# Altium project interface.PrjPcb
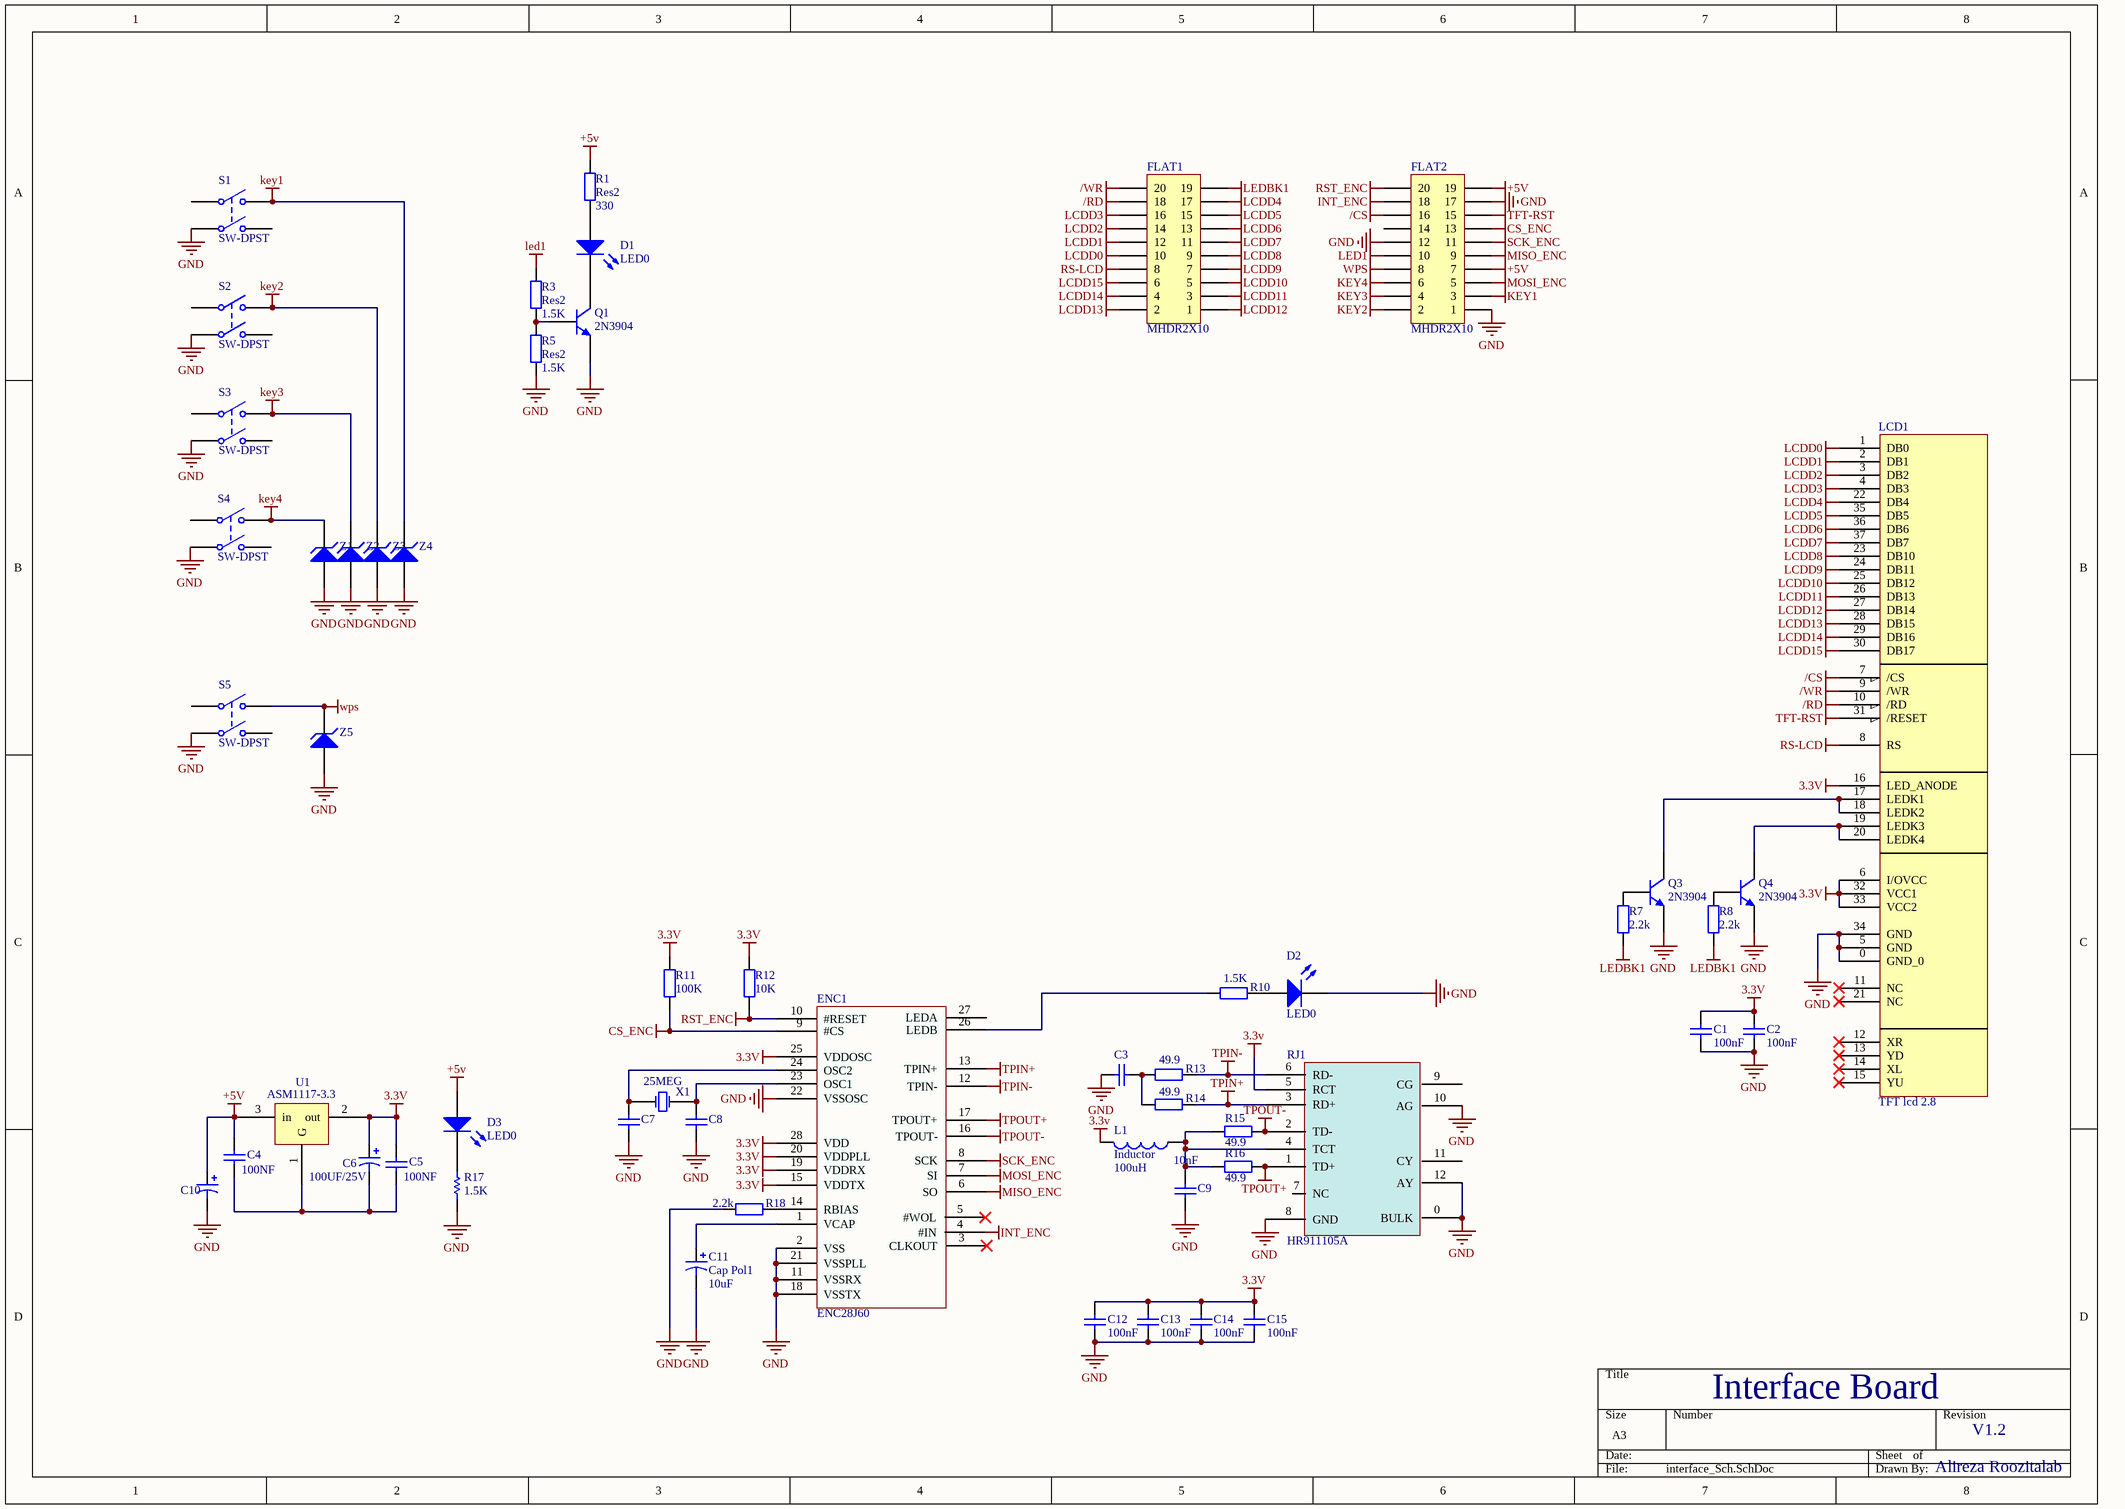
[diagram p0: interface_Sch.SchDoc]
1 sheet, 53 parts. Net scope: global (net labels, ports and power ports of the same name join across sheets).
Board file: interface_pcb.PcbDoc

## Sheet interface_Sch.SchDoc
size A3

### Parts
C1  value 100nF  [CAP 1206 (3216X08L)]  (hidden comment: Cap)
C2  value 100nF  [CAP 1206 (3216X08L)]  (hidden comment: Cap)
C3  Cap  [CAP 1206 (3216X08L)]  (value not drawn)
C4  value 100NF  [REC 10N]  (hidden comment: Cap)
C5  value 100NF  [REC 10N]  (hidden comment: Cap)
C6  value 100UF/25V  [POL 100U/25V]  (hidden comment: Cap Pol1)
C7  Cap  [CAP 1206 (3216X08L)]  (value not drawn)
C8  Cap  [CAP 1206 (3216X08L)]  (value not drawn)
C9  value 10nF  [CAP 1206 (3216X08L)]  (hidden comment: Cap)
C10  Cap Pol1  [POL 220U/35V]  (value not drawn)
C11  Cap Pol1  value 10uF  [POL 10U16V]
C12  value 100nF  [CAP 1206 (3216X08L)]  (hidden comment: Cap)
C13  value 100nF  [CAP 1206 (3216X08L)]  (hidden comment: Cap)
C14  value 100nF  [CAP 1206 (3216X08L)]  (hidden comment: Cap)
C15  value 100nF  [CAP 1206 (3216X08L)]  (hidden comment: Cap)
D1  LED0  [LED 3MM A]
D2  LED0  [LED 3MM A]
D3  LED0  [LED 3MM A]
ENC1  ENC28J60  [SOP28]
FLAT1  MHDR2X10  [box 20 smd]
FLAT2  MHDR2X10  [box 20 smd]
L1  Inductor  value 100uH  [TR]
LCD1  TFT lcd 2.8  [lcd 2.4 37pin]
Q1  2N3904  [2N3906_SMD]
Q3  2N3904  [2N3906_SMD]
Q4  2N3904  [2N3906_SMD]
R1  Res2  value 330  [RES 1206 (3216X08L)]
R3  Res2  value 1.5K  [RES 1206 (3216X08L)]
R5  Res2  value 1.5K  [RES 1206 (3216X08L)]
R7  value 2.2k  [RES 1206 (3216X08L)]  (hidden comment: Res2)
R8  value 2.2k  [RES 1206 (3216X08L)]  (hidden comment: Res2)
R10  value 1.5K  [RES 1206 (3216X08L)]  (hidden comment: Res2)
R11  value 100K  [RES 1206 (3216X08L)]  (hidden comment: Res2)
R12  value 10K  [RES 1206 (3216X08L)]  (hidden comment: Res2)
R13  value 49.9  [RES 1206 (3216X08L)]  (hidden comment: Res2)
R14  value 49.9  [RES 1206 (3216X08L)]  (hidden comment: Res2)
R15  value 49.9  [RES 1206 (3216X08L)]  (hidden comment: Res2)
R16  value 49.9  [RES 1206 (3216X08L)]  (hidden comment: Res2)
R17  value 1.5K  [RES 1206 (3216X08L)]  (hidden comment: Res1)
R18  value 2.2k  [RES 1206 (3216X08L)]  (hidden comment: Res2)
RJ1  HR911105A  [HR91105]
S1  SW-DPST  [SW4]
S2  SW-DPST  [SW4]
S3  SW-DPST  [SW4]
S4  SW-DPST  [SW4]
S5  SW-DPST  [SW4]
U1  ASM1117-3.3  [SOT-223]
X1  25MEG  [XTAL Small]
Z1  Zener 12V  [Diode-1n4148 - SMD PAD]  (value not drawn)
Z2  Zener 12V  [Diode-1n4148 - SMD PAD]  (value not drawn)
Z3  Zener 12V  [Diode-1n4148 - SMD PAD]  (value not drawn)
Z4  Zener 12V  [Diode-1n4148 - SMD PAD]  (value not drawn)
Z5  Zener 12V  [Diode-1n4148 - SMD PAD]  (value not drawn)

### Nets
3.3V: C1.2 C2.2 C5.2 C6.1 C12.1 C13.1 C14.1 C15.1 ENC1.15(VDDTX) ENC1.19(VDDRX) ENC1.20(VDDPLL) ENC1.25(VDDOSC) ENC1.28(VDD) L1.2 LCD1.6(I/OVCC) LCD1.16(LED_ANODE) LCD1.32(VCC1) LCD1.33(VCC2) R11.2 R12.2 RJ1.5(RCT) U1.2(out)
+5V: C4.2 C10.1 D3.1(A) FLAT2.7 FLAT2.19 R1.2 U1.3(in)
/CS: FLAT2.16 LCD1.7(/CS)
/RD: FLAT1.18 LCD1.10(/RD)
/WR: FLAT1.20 LCD1.9(/WR)
CS_ENC: ENC1.9(#CS) FLAT2.13 R11.1
GND: C1.1 C2.1 C3.1 C7.2 C8.2 C9.2 C10.2 C11.2 C12.2 C13.2 C14.2 C15.2 D2.2(K) ENC1.2(VSS) ENC1.11(VSSRX) ENC1.18(VSSTX) ENC1.21(VSSPLL) ENC1.22(VSSOSC) FLAT2.1 FLAT2.12 FLAT2.17 LCD1.0(GND_0) LCD1.5(GND) LCD1.34(GND) Q1.1(E) Q3.1(E) Q4.1(E) R5.1 R17.1 R18.1 RJ1.0(BULK) RJ1.8(GND) RJ1.10(AG) RJ1.12(AY) S1.3(COMMON2) S2.3(COMMON2) S3.3(COMMON2) S4.3(COMMON2) S5.3(COMMON2) Z1.1(A) Z2.1(A) Z3.1(A) Z4.1(A) Z5.1(A)
INT_ENC: ENC1.4(#IN) FLAT2.18
KEY1: FLAT2.3 S1.2(NO1) Z4.2(K)
KEY2: FLAT2.2 S2.2(NO1) Z3.2(K)
KEY3: FLAT2.4 S3.2(NO1) Z2.2(K)
KEY4: FLAT2.6 S4.2(NO1) Z1.2(K)
LCDD0: FLAT1.10 LCD1.1(DB0)
LCDD1: FLAT1.12 LCD1.2(DB1)
LCDD2: FLAT1.14 LCD1.3(DB2)
LCDD3: FLAT1.16 LCD1.4(DB3)
LCDD4: FLAT1.17 LCD1.22(DB4)
LCDD5: FLAT1.15 LCD1.35(DB5)
LCDD6: FLAT1.13 LCD1.36(DB6)
LCDD7: FLAT1.11 LCD1.37(DB7)
LCDD8: FLAT1.9 LCD1.23(DB10)
LCDD9: FLAT1.7 LCD1.24(DB11)
LCDD10: FLAT1.5 LCD1.25(DB12)
LCDD11: FLAT1.3 LCD1.26(DB13)
LCDD12: FLAT1.1 LCD1.27(DB14)
LCDD13: FLAT1.2 LCD1.28(DB15)
LCDD14: FLAT1.4 LCD1.29(DB16)
LCDD15: FLAT1.6 LCD1.30(DB17)
led1: FLAT2.10 R3.2
LEDBK1: FLAT1.19 R7.1 R8.2
MISO_ENC: ENC1.6(SO) FLAT2.9
MOSI_ENC: ENC1.7(SI) FLAT2.5
RS-LCD: FLAT1.8 LCD1.8(RS)
RST_ENC: ENC1.10(#RESET) FLAT2.20 R12.1
SCK_ENC: ENC1.8(SCK) FLAT2.11
TFT-RST: FLAT2.15 LCD1.31(/RESET)
TPIN+: ENC1.13(TPIN+) R14.2 RJ1.3(RD+)
TPIN-: ENC1.12(TPIN-) R13.2 RJ1.6(RD-)
TPOUT+: ENC1.17(TPOUT+) R16.1 RJ1.1(TD+)
TPOUT-: ENC1.16(TPOUT-) R15.1 RJ1.2(TD-)
WPS: FLAT2.8 S5.2(NO1) Z5.2(K)
NetC3_2: C3.2 R13.1 R14.1
NetC4_1: C4.1 C5.1 C6.2 U1.1(G)
NetC7_1: C7.1 ENC1.24(OSC2) X1.1(OSC1)
NetC8_1: C8.1 ENC1.23(OSC1) X1.2(OSC2)
NetC9_1: C9.1 L1.1 R15.2 R16.2 RJ1.4(TCT)
NetC11_1: C11.1 ENC1.1(VCAP)
NetD1_1: D1.1(A) R1.1
NetD1_2: D1.2(K) Q1.3(C)
NetD2_1: D2.1(A) R10.2
NetD3_2: D3.2(K) R17.2
NetENC1_14: ENC1.14(RBIAS) R18.2
NetENC1_26: ENC1.26(LEDB) R10.1
NetLCD1_17: LCD1.17(LEDK1) LCD1.18(LEDK2) Q3.3(C)
NetLCD1_19: LCD1.19(LEDK3) LCD1.20(LEDK4) Q4.3(C)
NetQ1_2: Q1.2(B) R3.1 R5.2
NetQ3_2: Q3.2(B) R7.2
NetQ4_2: Q4.2(B) R8.1

Not connected (* = marked no-connect by the designer): ENC1 3(CLKOUT)* 5(#WOL)* 27(LEDA); FLAT2 14; LCD1 11(NC)* 12(XR)* 13(YD)* 14(XL)* 15(YU)* 21(NC)*; RJ1 7(NC) 9(CG) 11(CY); S1 1(COMMON1) 4(NO2); S2 1(COMMON1) 4(NO2); S3 1(COMMON1) 4(NO2); S4 1(COMMON1) 4(NO2); S5 1(COMMON1) 4(NO2)

### Notes on the sheet
- Interface Board
- V1.2
- Alireza Roozitalab

### Library data of the parts
C1 C2 C4 C5 C9 C12-C15 = Cap: Capacitor; Published: 8-Jun-2000; LatestRevisionDate: 17-Jul-2002; LatestRevisionNote: Re-released for DXP Platform.; PackageReference: RAD-0.3; Publisher: Altium Limited
C3 C7 C8 = Cap: Capacitor; Value: 100nF; Published: 8-Jun-2000; LatestRevisionDate: 17-Jul-2002; LatestRevisionNote: Re-released for DXP Platform.; PackageReference: RAD-0.3; Publisher: Altium Limited
C6 C11 = Cap Pol1: Polarized Capacitor (Radial); Published: 8-Jun-2000; LatestRevisionDate: 17-Jul-2002; LatestRevisionNote: Re-released for DXP Platform.; PackageReference: RB7.6-15; Publisher: Altium Limited
C10 = Cap Pol1: Polarized Capacitor (Radial); Value: 100UF/25v; Published: 8-Jun-2000; LatestRevisionDate: 17-Jul-2002; LatestRevisionNote: Re-released for DXP Platform.; PackageReference: RB7.6-15; Publisher: Altium Limited
D1-D3 = LED0: Typical INFRARED GaAs LED; Published: 8-Jun-2000; LatestRevisionDate: 08-Jul-2005; LatestRevisionNote: Mech Layer 1 removed.; PackageReference: LED-0; Publisher: Altium Limited
FLAT1 FLAT2 = MHDR2X10: Header, 10-Pin, Dual row; LatestRevisionDate: 17-Jul-2002; LatestRevisionNote: Re-released for DXP Platform.; Publisher: Altium Limited
L1 = Inductor: Code_IEC: 1005; Published: 8-Jun-2000; LatestRevisionDate: 17-Jul-2002; LatestRevisionNote: Re-released for DXP Platform.; PackageReference: 0402-A; Publisher: Altium Limited; Code_JEITA: 0402
Q1 Q3 Q4 = 2N3904: NPN General Purpose Amplifier; pin to pad: 1>2 2>1; Published: 8-Jun-2000; LatestRevisionDate: 15-Jan-2003; LatestRevisionNote: PCB Footprint 'BCY-W3/D4.7' replaced; DatasheetDocument: 1997; PackageDocument: Sep-1998; PackageReference: TO-92A; Publisher: Altium Limited; Code_JEDEC: TO-92A; ComponentLink1Description: Manufacturer Link; ComponentLink1URL: http://www.fairchildsemi.com/; ComponentLink2Description: Datasheet; ComponentLink2URL: http://www.fairchildsemi.com/ds/2N%2F2N3904.pdf
R1 R3 R5 R7 R8 R10-R16 R18 = Res2: Resistor; Published: 8-Jun-2000; LatestRevisionDate: 17-Jul-2002; LatestRevisionNote: Re-released for DXP Platform.; PackageReference: AXIAL-0.4; Publisher: Altium Limited
R17 = Res1: Resistor; Published: 8-Jun-2000; LatestRevisionDate: 17-Jul-2002; LatestRevisionNote: Re-released for DXP Platform.; PackageReference: AXIAL-0.3; Publisher: Altium Limited
S1-S5 = SW-DPST: Double-Pole, Single-Throw Switch; Published: 24-Mar-1999; LatestRevisionDate: 17-Jul-2002; LatestRevisionNote: Re-released for DXP Platform.; PackageReference: DPST-4; Publisher: Altium Limited
X1 = XTAL: Crystal Oscillator; Published: 8-Jun-2000; LatestRevisionDate: 17-Jul-2002; LatestRevisionNote: Re-released for DXP Platform.; PackageReference: R38; Publisher: Altium Limited
Z1-Z5 = D Zener: Zener Diode; Published: 8-Jun-2000; LatestRevisionDate: 17-Jul-2002; LatestRevisionNote: Re-released for DXP Platform.; PackageReference: DIODE-0.7; Publisher: Altium Limited